# EasyEDA schematic SCH_Uhhhhhhh_2025-04-25.json
TITLE: Sheet_1; REV: 1.0; Date: 2025-02-11; Sheet: 1/1; Drawn By: uhhhhben; Company: Your Company
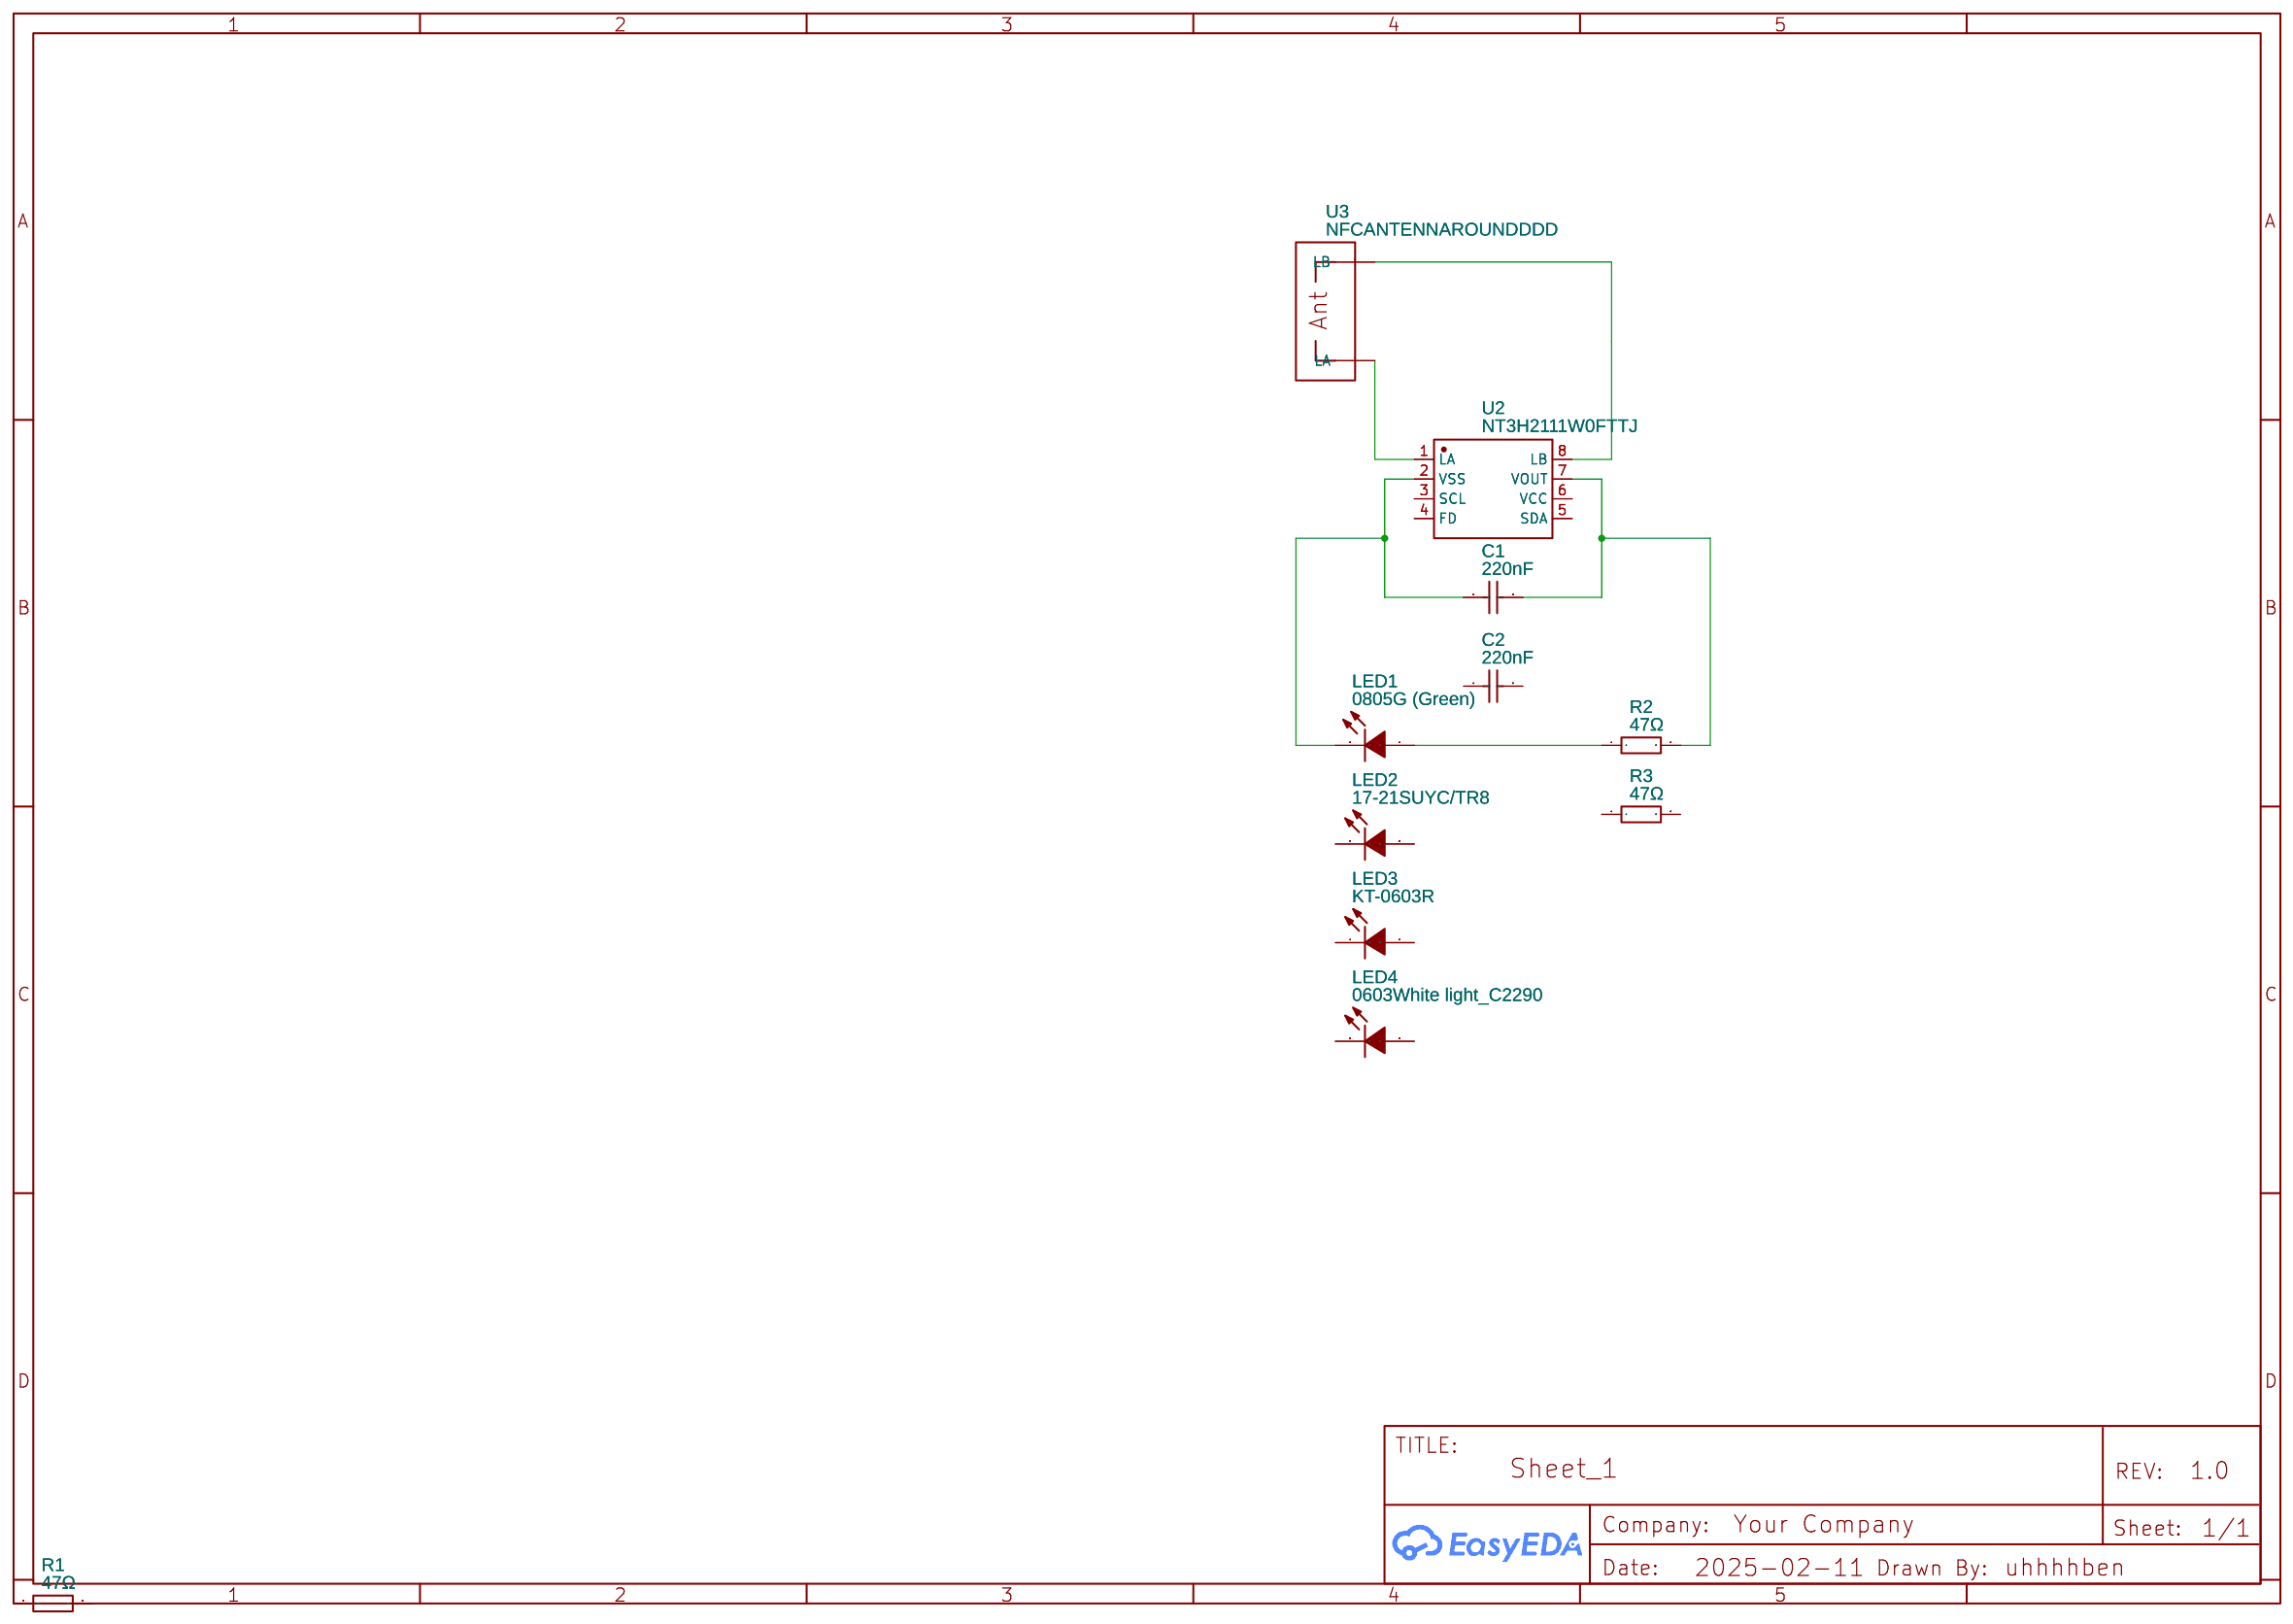
[diagram p0: schematic sheet]

## Parts
C1  220nF  [C0402]
C2  220nF  [C0402]
LED1  0805G (Green)  [LED0805-R-RD]
LED2  17-21SUYC/TR8  [LED0805-R-RD]
LED3  KT-0603R  [LED0603-RD]
LED4  0603White light_C2290  [LED0603-R-RD_WHITE]
R1  47Ω  [R0603]
R2  47Ω  [R0603]
R3  47Ω  [R0603]
U2  NT3H2111W0FTTJ  [TSSOP-8_L3.0-W3.0-P0.65-LS4.9-BL]
U3  NFCANTENNAROUNDDDD  [NFC ANTENNA V3]

## Library data of the parts
C1 C2 = CL05B224KO5NNNC: Supplier: LCSC; Manufacturer: SAMSUNG(三星); Supplier Part: C16772; JLCPCB Part Class: Basic Part
LED1 = 0805G (Green): Supplier: LCSC; Manufacturer: KENTO; Manufacturer Part: KT-0805G; Supplier Part: C2297; JLCPCB Part Class: Basic Part
LED2 = 17-21SUYC/TR8: Supplier: LCSC; Manufacturer: KENTO; Manufacturer Part: KT-0805黄灯; Supplier Part: C2296; JLCPCB Part Class: Basic Part
LED3 = KT-0603R: Supplier: LCSC; Manufacturer: KENTO; Supplier Part: C2286; JLCPCB Part Class: Basic Part
LED4 = 0603White light_C2290: Supplier: LCSC; Manufacturer: KENTO; Manufacturer Part: KT-0603W; Supplier Part: C2290; JLCPCB Part Class: Basic Part
R1-R3 = 0603WAF470JT5E: Supplier: LCSC; Manufacturer: UNI-ROYAL(厚声); Supplier Part: C23182; JLCPCB Part Class: Basic Part
U2 = NT3H2111W0FTTJ: Contributor: LCSC; Supplier: LCSC; Supplier Part: C2654884; Manufacturer: NXP(恩智浦); JLCPCB Part Class: Extended Part
U3 = NFCANTENNAROUNDDDD: Contributor: ywolvekamp

## Nets
Net-(C1-1): C1.1 LED1.2(K) U2.2(VSS)
Net-(C1-2): C1.2 R2.2 U2.7(VOUT)
Net-(LED1-1): LED1.1(A) R2.1
Net-(U2-1): U2.1(LA) U3.LA
Net-(U2-8): U2.8(LB) U3.LB

Not connected (* = marked no-connect by the designer): C2 1 2; LED2 1(+) 2(-); LED3 1(K) 2(A); LED4 1(A) 2(K); R1 1 2; R3 1 2; U2 3(SCL) 4(FD) 5(SDA) 6(VCC)
